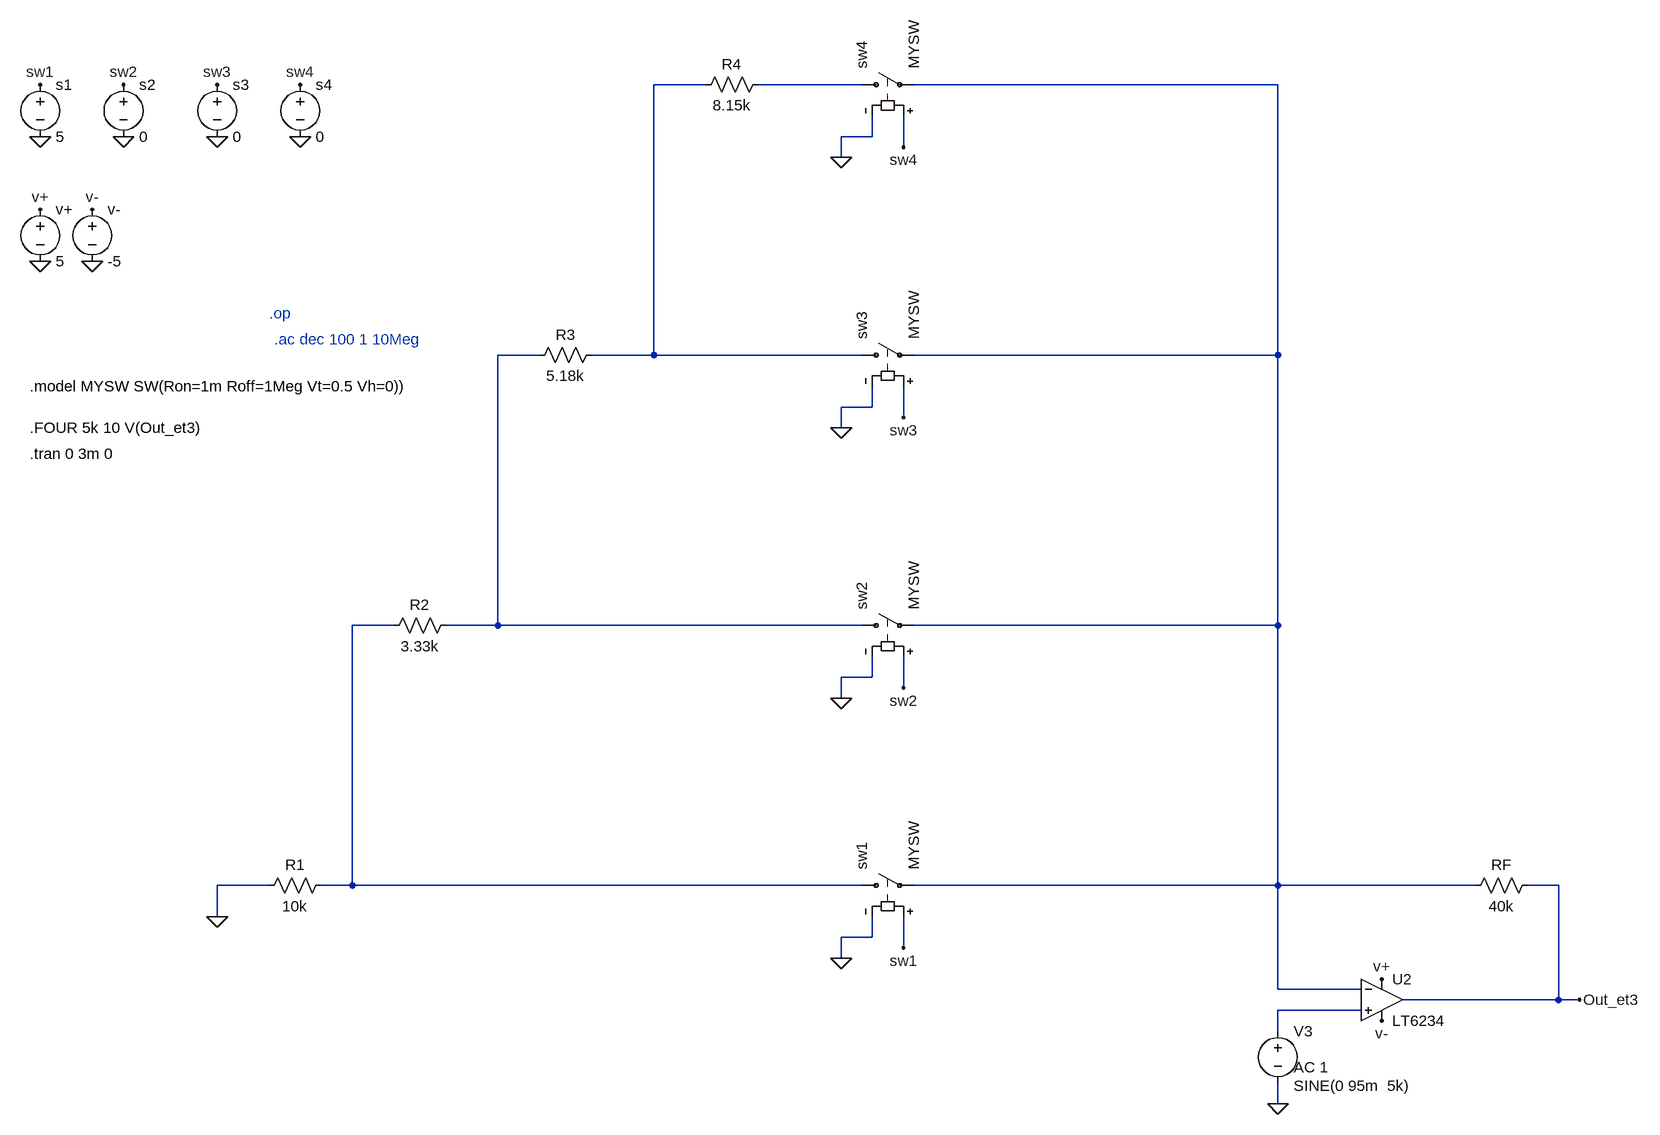
[diagram p0: schematic etaj3_swIdeal.asc]
etaj3_swIdeal.asc, the LTspice schematic file:
Version 4
SHEET 1 1560 740
WIRE -512 -848 -592 -848
WIRE -272 -848 -432 -848
WIRE 368 -848 -192 -848
WIRE -256 -768 -256 -800
WIRE -256 -768 -304 -768
WIRE -208 -752 -208 -800
WIRE -304 -736 -304 -768
WIRE -768 -432 -832 -432
WIRE -592 -432 -592 -848
WIRE -592 -432 -688 -432
WIRE -272 -432 -592 -432
WIRE 368 -432 368 -848
WIRE 368 -432 -192 -432
WIRE -256 -352 -256 -384
WIRE -256 -352 -304 -352
WIRE -208 -336 -208 -384
WIRE -304 -320 -304 -352
WIRE -992 -16 -1056 -16
WIRE -832 -16 -832 -432
WIRE -832 -16 -912 -16
WIRE -272 -16 -832 -16
WIRE 368 -16 368 -432
WIRE 368 -16 -192 -16
WIRE -256 64 -256 32
WIRE -256 64 -304 64
WIRE -208 80 -208 32
WIRE -304 96 -304 64
WIRE -1184 384 -1264 384
WIRE -1056 384 -1056 -16
WIRE -1056 384 -1104 384
WIRE -272 384 -1056 384
WIRE 368 384 368 -16
WIRE 368 384 -192 384
WIRE 672 384 368 384
WIRE 800 384 752 384
WIRE -1264 432 -1264 384
WIRE -256 464 -256 432
WIRE -256 464 -304 464
WIRE -208 480 -208 432
WIRE -304 496 -304 464
WIRE 368 544 368 384
WIRE 496 544 368 544
WIRE 800 560 800 384
WIRE 800 560 560 560
WIRE 832 560 800 560
WIRE 496 576 368 576
WIRE 368 608 368 576
WIRE 368 720 368 688
FLAG -1536 -576 0
FLAG -1456 -576 0
FLAG -1536 -656 v+
FLAG -1456 -656 v-
FLAG 528 528 v+
FLAG 528 592 v-
FLAG -1264 432 0
FLAG 368 720 0
FLAG 832 560 Out_et3
FLAG -1536 -768 0
FLAG -1408 -768 0
FLAG -1264 -768 0
FLAG -1136 -768 0
FLAG -1536 -848 sw1
FLAG -1408 -848 sw2
FLAG -1264 -848 sw3
FLAG -1136 -848 sw4
FLAG -208 480 sw1
FLAG -304 496 0
FLAG -208 80 sw2
FLAG -304 96 0
FLAG -208 -336 sw3
FLAG -304 -320 0
FLAG -208 -752 sw4
FLAG -304 -736 0
SYMBOL OpAmps\\LT6234 528 560 R0
SYMATTR InstName U2
SYMBOL voltage -1536 -672 R0
WINDOW 123 0 0 Left 0
WINDOW 39 0 0 Left 0
SYMATTR InstName v+
SYMATTR Value 5
SYMBOL voltage -1456 -672 R0
WINDOW 123 0 0 Left 0
WINDOW 39 0 0 Left 0
SYMATTR InstName v-
SYMATTR Value -5
SYMBOL res 768 368 R90
WINDOW 0 0 56 VBottom 2
WINDOW 3 32 56 VTop 2
SYMATTR InstName RF
SYMATTR Value 40k
SYMBOL res -416 -864 R90
WINDOW 0 0 56 VBottom 2
WINDOW 3 32 56 VTop 2
SYMATTR InstName R4
SYMATTR Value 8.15k
SYMBOL res -672 -448 R90
WINDOW 0 0 56 VBottom 2
WINDOW 3 32 56 VTop 2
SYMATTR InstName R3
SYMATTR Value 5.18k
SYMBOL res -896 -32 R90
WINDOW 0 0 56 VBottom 2
WINDOW 3 32 56 VTop 2
SYMATTR InstName R2
SYMATTR Value 3.33k
SYMBOL res -1088 368 R90
WINDOW 0 0 56 VBottom 2
WINDOW 3 32 56 VTop 2
SYMATTR InstName R1
SYMATTR Value 10k
SYMBOL voltage 368 592 R0
WINDOW 3 24 100 Left 2
WINDOW 123 24 72 Left 2
WINDOW 39 0 0 Left 0
SYMATTR Value SINE(0 95m  5k)
SYMATTR Value2 AC 1
SYMATTR InstName V3
SYMBOL voltage -1536 -864 R0
WINDOW 123 0 0 Left 0
WINDOW 39 0 0 Left 0
SYMATTR InstName s1
SYMATTR Value 5
SYMBOL voltage -1408 -864 R0
SYMATTR InstName s2
SYMATTR Value 0
SYMBOL voltage -1264 -864 R0
SYMATTR InstName s3
SYMATTR Value 0
SYMBOL voltage -1136 -864 R0
WINDOW 123 0 0 Left 0
WINDOW 39 0 0 Left 0
SYMATTR InstName s4
SYMATTR Value 0
SYMBOL sw -288 384 R270
SYMATTR InstName sw1
SYMATTR Value MYSW
SYMBOL sw -288 -16 R270
SYMATTR InstName sw2
SYMATTR Value MYSW
SYMBOL sw -288 -432 R270
SYMATTR InstName sw3
SYMATTR Value MYSW
SYMBOL sw -288 -848 R270
SYMATTR InstName sw4
SYMATTR Value MYSW
TEXT -1184 -496 Left 2 ;.op
TEXT -1176 -456 Left 2 ;.ac dec 100 1 10Meg
TEXT -1552 -384 Left 2 !.model MYSW SW(Ron=1m Roff=1Meg Vt=0.5 Vh=0))
TEXT -1552 -320 Left 2 !.FOUR 5k 10 V(Out_et3)
TEXT -1552 -280 Left 2 !.tran 0 3m 0

The netlist it stands for:
* etaj3_swIdeal.asc
* U2: LT6234 (symbol OpAmps\LT6234 not available, pins judged from their places): In+=N006 In-=N003 V+=v+ V-=v- OUT=Out_et3
v+ v+ 0 5
v- v- 0 -5
RF Out_et3 N003 40k
R4 N002 N001 8.15k
R3 N001 N004 5.18k
R2 N004 N005 3.33k
R1 N005 0 10k
V3 N006 0 SINE(0 95m  5k) AC 1
V§s1 sw1 0 5
V§s2 sw2 0 0
V§s3 sw3 0 0
V§s4 sw4 0 0
sw1 N005 N003 sw1 0 MYSW
sw2 N004 N003 sw2 0 MYSW
sw3 N001 N003 sw3 0 MYSW
sw4 N002 N003 sw4 0 MYSW
* .op
* .ac dec 100 1 10Meg
.model MYSW SW(Ron=1m Roff=1Meg Vt=0.5 Vh=0))
.FOUR 5k 10 V(Out_et3)
.tran 0 3m 0
.backanno
.end